# EAGLE board shieldRelayV2 (EAGLE 9.6.2)
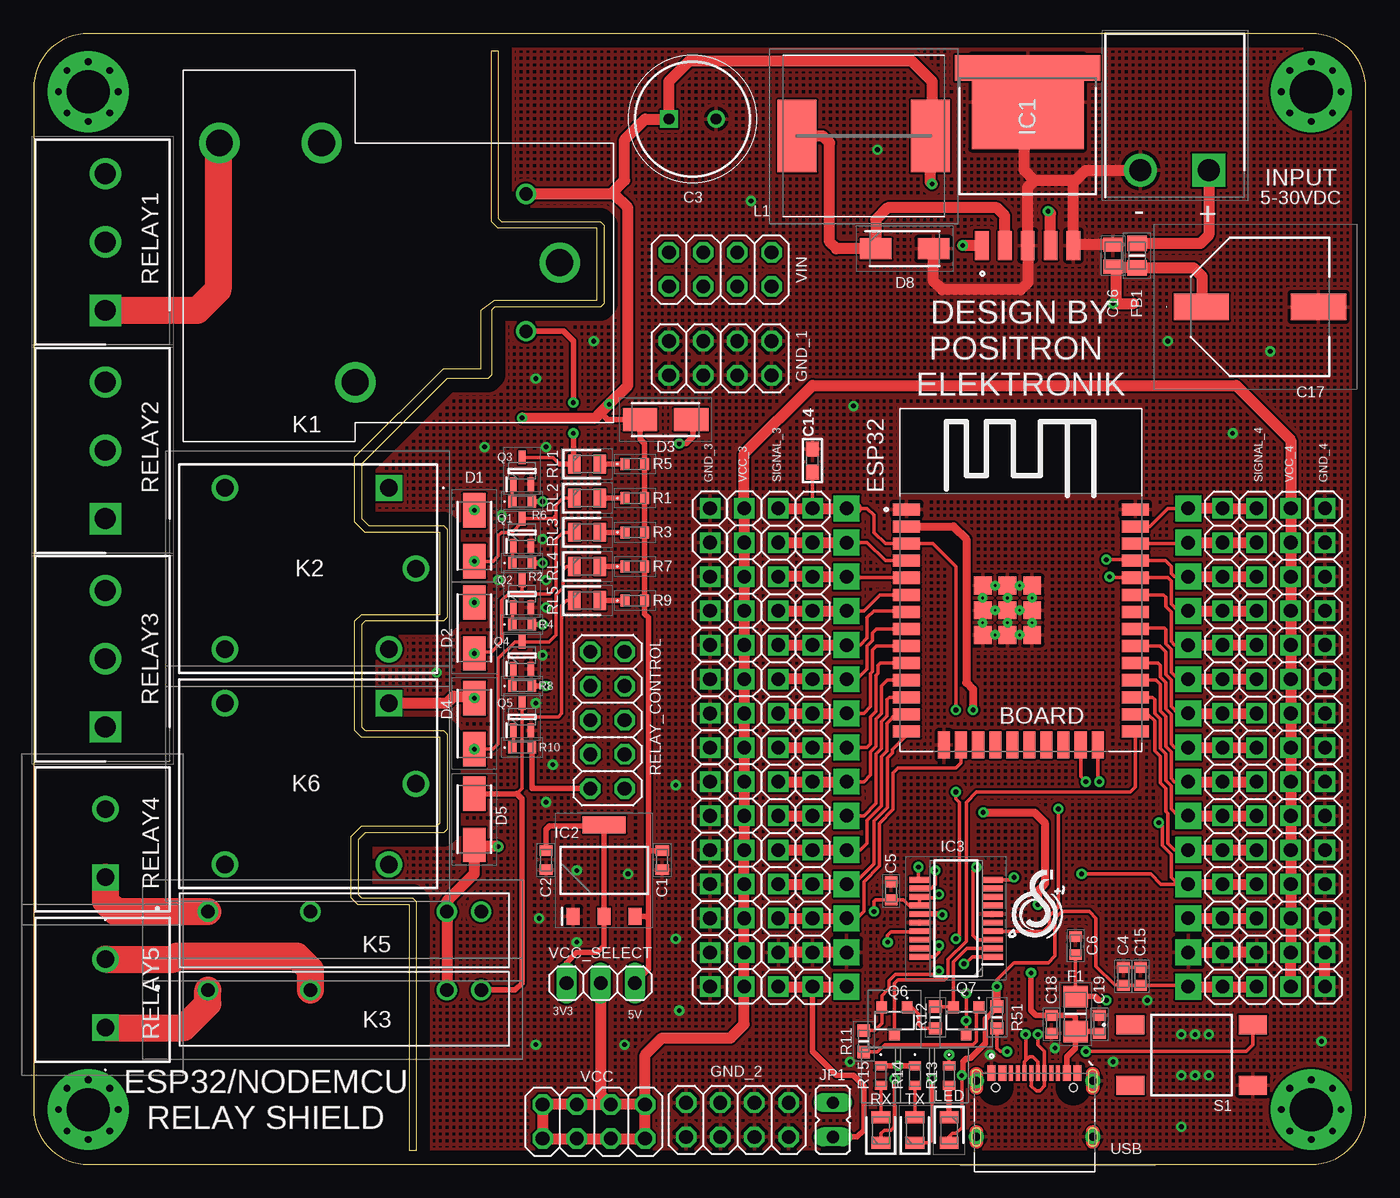
[diagram p3: board, top side]
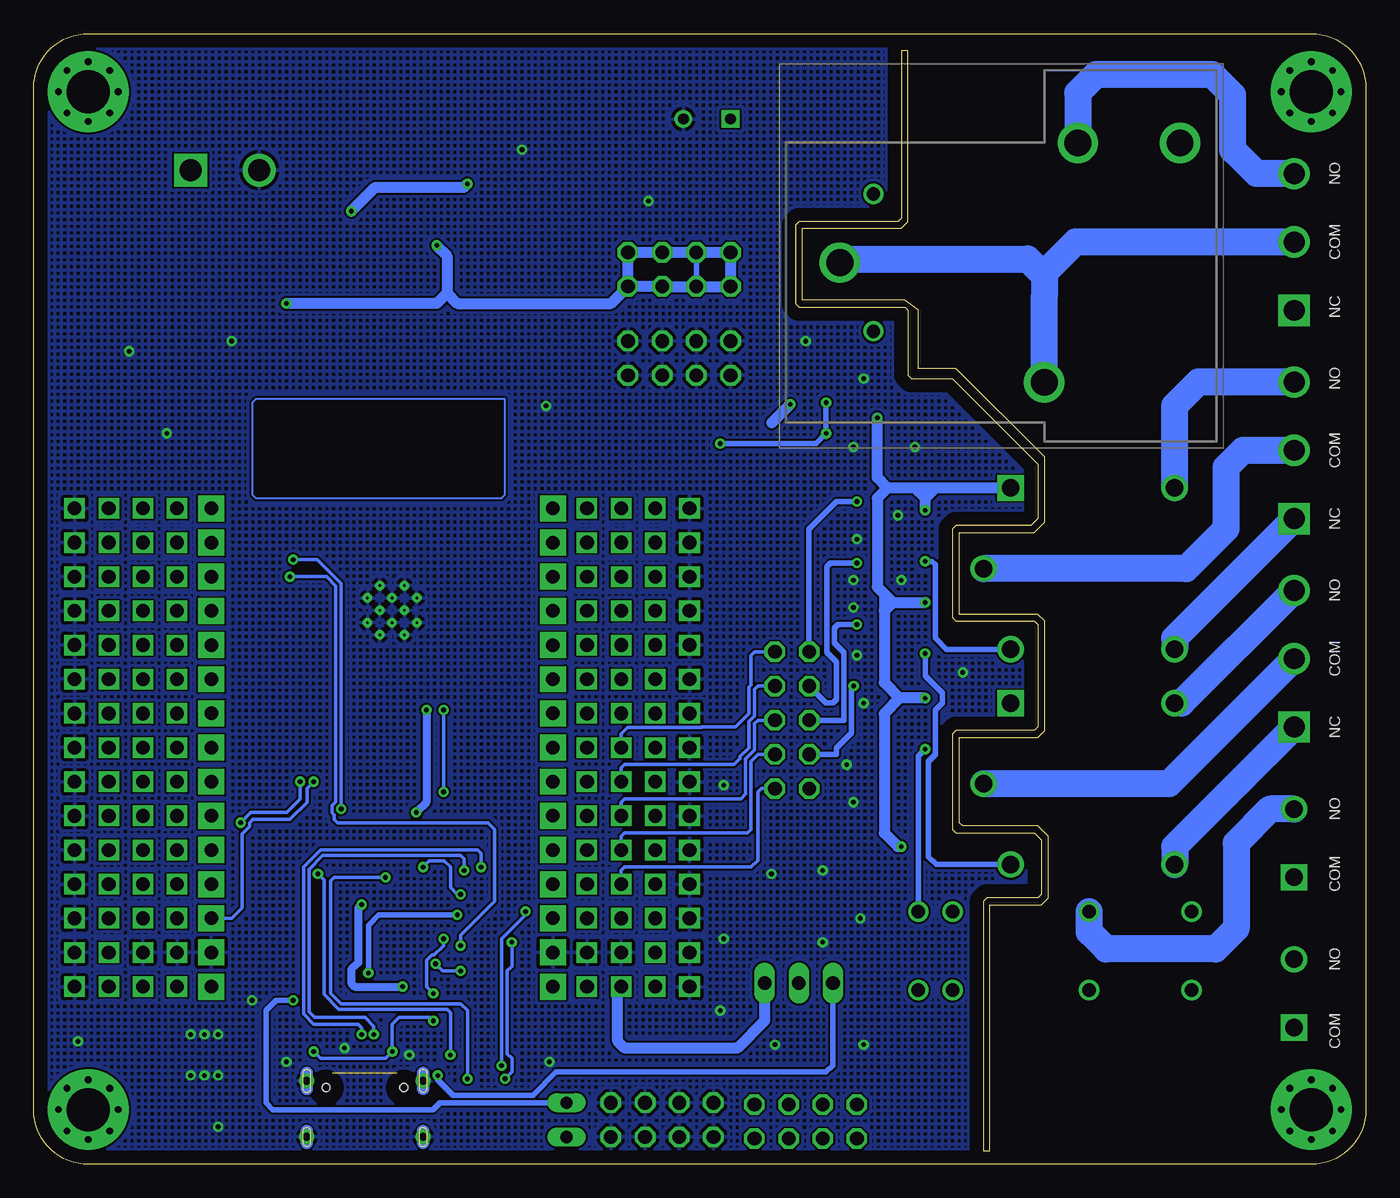
[diagram p4: board, bottom side, seen from below]

Size 99.06 x 84.07 mm. Coordinates in mm from the lower left corner, seen from the top.
Outline: 4.06,84.07 arc90 0,80.01 0,4.06 arc90 4.06,0 95,0 arc90 99.06,4.06 99.06,80.01 arc90 95,84.07 4.06,84.07
Outline: 34.54,82.8 34.54,70.36 34.8,70.1 42.16,70.1 42.42,69.85 42.42,64.01 42.16,63.75 34.29,63.75 34.04,63.5 34.04,58.67 33.78,58.42 30.73,58.42 24.38,52.07 24.38,48.01 24.89,47.5 30.48,47.5 30.73,47.24 30.73,40.64 30.48,40.39 24.64,40.39 24.38,40.13 24.38,32.51 24.64,32.26 30.48,32.26 30.73,32 30.73,24.89 30.48,24.64 24.64,24.64 24.13,24.13 24.13,20.07 24.38,19.81 28.19,19.81 28.45,19.56 28.45,1.02 27.94,1.02 27.94,19.3 24.13,19.3 23.62,19.81 23.62,24.38 24.38,25.15 29.97,25.15 30.23,25.4 30.23,31.75 24.38,31.75 23.88,32.26 23.88,40.39 24.38,40.89 30.23,40.89 30.23,46.99 24.64,46.99 23.88,47.75 23.88,52.58 30.48,59.18 33.27,59.18 33.27,63.5 34.29,64.26 41.91,64.26 41.91,69.6 34.54,69.6 34.04,70.1 34.04,82.8 34.54,82.8
Copper layers (1*16): Top 0.035mm / dielectric 1.5mm / Bottom 0.035mm
Design rules "default *": minimum track width 6mil, minimum drill 0.35mm, track to track 6mil, track to pad 6mil, pad to pad 6mil, via to via 6mil, smd to smd 6mil, copper to edge 40mil, drill to drill 6mil, minimum pad ring 10mil, minimum via ring 8mil, stop-mask expansion 4mil, vias tented up to drill 0.36mm, thermal gap 10mil

## Footprints (pad centres in the part's own frame; a part is rotated, then mirrored left to right if it is on the bottom)
ESP32-DEVKITV1 = drill 1 pad 1.93 square: 3V3 0,0; D1 30.48,0; D2 7.62,0; D3 27.94,0; D4 10.16,0; D5 17.78,0; D12 7.62,25.4; D13 5.08,25.4; D14 10.16,25.4; D15 5.08,0; D16 12.7,0; D17 15.24,0; D18 20.32,0; D19 22.86,0; D21 25.4,0; D22 33.02,0; D23 35.56,0; D25 17.78,25.4; D26 15.24,25.4; D27 12.7,25.4; D32 22.86,25.4; D33 20.32,25.4; D34 27.94,25.4; D35 25.4,25.4; EN 35.56,25.4; GND 2.54,25.4; GND@1 2.54,0; VIN 0,25.4; VN 30.48,25.4; VP 33.02,25.4
CAPC1608X95N = smd 0.78 x 0.99: 1 -0.7,0; 2 0.7,0
CAPPRD350W60D850H1250 = drill 0.8 pad 1.2 square: 1 0,0 | drill 0.8 pad 1.2: 2 3.5,0
CAPC1608X87N = smd 0.8 x 0.94: 1 -0.67,0; 2 0.67,0
0603 = smd 1.1 x 1: 1 -0.85,0; 2 0.85,0
CAPC2012X140N = smd 1.02 x 1.47: 1 -0.81,0; 2 0.81,0
EEHZS1H221P = smd 4.1 x 2: 1 -4.35,0; 2 4.35,0
DIONM5025X231N = smd 2.55 x 1.7: 1 -1.9,0; 2 1.9,0
DIOM5226X240N = smd 2.35 x 1.55: 1 -2.15,0; 2 2.15,0
MODULE_ESP32-WROOM-32D = smd 2 x 0.9: 1 -8.5,5.26; 2 -8.5,3.99; 3 -8.5,2.72; 4 -8.5,1.45; 5 -8.5,0.18; 6 -8.5,-1.09; 7 -8.5,-2.36; 8 -8.5,-3.63; 9 -8.5,-4.9; 10 -8.5,-6.17; 11 -8.5,-7.44; 12 -8.5,-8.71; 13 -8.5,-9.98; 14 -8.5,-11.25; 25 8.5,-11.25; 26 8.5,-9.98; 27 8.5,-8.71; 28 8.5,-7.44; 29 8.5,-6.17; 30 8.5,-4.9; 31 8.5,-3.63; 32 8.5,-2.36; 33 8.5,-1.09; 34 8.5,0.18; 35 8.5,1.45; 36 8.5,2.72; 37 8.5,3.99; 38 8.5,5.26 | smd 0.9 x 2: 15 -5.715,-12.25; 16 -4.445,-12.25; 17 -3.175,-12.25; 18 -1.905,-12.25; 19 -0.635,-12.25; 20 0.635,-12.25; 21 1.905,-12.25; 22 3.175,-12.25; 23 4.445,-12.25; 24 5.715,-12.25 | smd 1.33 x 1.33: 39_1 -2.835,-0.405; 39_2 -1,-0.405; 39_3 0.835,-0.405; 39_4 -2.835,-2.24; 39_5 -1,-2.24; 39_6 0.835,-2.24; 39_7 -2.835,-4.075; 39_8 -1,-4.075; 39_9 0.835,-4.075 | drill 0.2 pad 0.3: 39_10 -1.917,-0.405; 39_11 -0.083,-0.405; 39_12 -2.835,-1.323; 39_13 -1,-1.323; 39_14 0.835,-1.323; 39_15 -1.917,-2.24; 39_16 -0.083,-2.24; 39_17 -2.835,-3.158; 39_18 -1,-3.158; 39_19 0.835,-3.158; 39_20 -1.917,-4.075; 39_21 -0.083,-4.075
FUSC3216X75N = smd 1.61 x 1.82: 1 -1.3,0; 2 1.3,0
BEADC2012X105N = smd 1.15 x 1.45: 1 -0.9,0; 2 0.9,0
2X04 = drill 1.016 octagon: 1 -3.81,-1.27; 2 -3.81,1.27; 3 -1.27,-1.27; 4 -1.27,1.27; 5 1.27,-1.27; 6 1.27,1.27; 7 3.81,-1.27; 8 3.81,1.27
1X15 = drill 1.016 square: 1 -17.78,0; 2 -15.24,0; 3 -12.7,0; 4 -10.16,0; 5 -7.62,0; 6 -5.08,0; 7 -2.54,0; 8 0,0; 9 2.54,0; 10 5.08,0; 11 7.62,0; 12 10.16,0; 13 12.7,0; 14 15.24,0; 15 17.78,0
3MM_HOLE = drill 3.2 pad 6: P$1 0,0 | drill 0.5 pad 0.61: P$2 0,2.223; P$3 0,-2.223; P$4 2.223,0; P$5 -2.223,0; P$6 -1.587,1.587; P$7 1.587,1.587; P$8 1.587,-1.587; P$9 -1.587,-1.587
KTT0005B = smd 2.16 x 1.02: 1 12.461,-3.4; 2 12.461,-1.7; 3 12.461,0; 4 12.461,1.7; 5 12.461,3.4 | smd 6.99 x 8.33: 6 1.786,0 | smd 1.91 x 1.235: 7 -0.754,4.782; 8 -0.754,-4.782
SOT230P700X180-4N = smd 1.25 x 0.95: 1 -3.4,2.3; 2 -3.4,0; 3 -3.4,-2.3 | smd 1.25 x 3.2: 4 3.4,0
SOP64P599X175-20N = smd 1.526 x 0.435: 1 -2.712,2.858; 2 -2.712,2.222; 3 -2.712,1.588; 4 -2.712,0.952; 5 -2.712,0.318; 6 -2.712,-0.318; 7 -2.712,-0.952; 8 -2.712,-1.588; 9 -2.712,-2.222; 10 -2.712,-2.858; 11 2.712,-2.858; 12 2.712,-2.222; 13 2.712,-1.588; 14 2.712,-0.952; 15 2.712,-0.318; 16 2.712,0.318; 17 2.712,0.952; 18 2.712,1.588; 19 2.712,2.222; 20 2.712,2.858
SHDRRA2W103P0X508_1X2_1016X120 = drill 1.65 pad 2.475 square: 1 0,0 | drill 1.65 pad 2.475: 2 -5.08,0
JP1 = drill 0.914 long: 1 0,-1.27; 2 0,1.27
SLA05VDCSLC = drill 2 pad 3: 1 0,0; 2 8.9,15.2; 3 -8.9,17.7; 4 -8.9,25.3 | drill 1 pad 1.5: 5 5.1,2.5; 6 -5.1,2.5
SRD05VDCSLC = drill 1.3 pad 1.95 square: 1 0,0 | drill 1.3 pad 1.95: 2 12.2,0; 3 12.2,12; 4 0,12; 5 -2,6
G3MB202PLDC5 = drill 1 pad 1.5: 1 0,0; 2 -7.62,0; 3 -17.78,0; 4 -20.32,0
WE-PD_1260/1245/1280/121054 = smd 2.9 x 5.4: 1 -4.95,0; 2 4.95,0
LEDC2012X80N = smd 0.9 x 1.4: 1 -0.95,0; 2 0.95,0
SOT65P210X110-3N = smd 1 x 0.5: 1 -1,0.65; 2 -1,-0.65; 3 1,0
SI2305TP = smd 0.8 x 0.9: 1 -0.95,-1; 2 0.95,-1; 3 0,1
ERA3AEB101V = smd 0.65 x 0.9: 1 -0.725,0; 2 0.725,0
RESC1608X55N = smd 0.9 x 0.95: 1 -0.8,0; 2 0.8,0
ERJH3 = smd 0.65 x 0.9: 1 -0.725,0; 2 0.725,0
SHDR3W95P0X508_1X3_1524X1000X1 = drill 1.55 pad 2.325 square: 1 0,0 | drill 1.55 pad 2.325: 2 5.08,0; 3 10.16,0
1716080000 = drill 1.3 pad 1.95 square: 1 0,0 | drill 1.3 pad 1.95: 2 5.08,0
2X05 = drill 1.016 octagon: 1 -5.08,-1.27; 2 -5.08,1.27; 3 -2.54,-1.27; 4 -2.54,1.27; 5 0,-1.27; 6 0,1.27; 7 2.54,-1.27; 8 2.54,1.27; 9 5.08,-1.27; 10 5.08,1.27
FSM2J_1 = smd 1.4 x 2.1: 1 2.25,4.55; 2 2.25,-4.55; 3 -2.25,4.55; 4 -2.25,-4.55
HRO_TYPE-C-31-M-12 = smd 0.6 x 1.14: A1_B12 -3.2,4.75; A4_B9 -2.4,4.75; B1_A12 3.2,4.75; B4_A9 2.4,4.75 | smd 0.3 x 1.14: A5 -1.25,4.75; A6 -0.25,4.75; A7 0.25,4.75; A8 1.25,4.75; B5 1.75,4.75; B6 0.75,4.75; B7 -0.75,4.75; B8 -1.75,4.75 | drill 0.6 pad 0.9: S1 -4.325,4.17; S2 4.325,4.17; S3 -4.325,0; S4 4.325,0 | hole 0.6: -2.89,3.68; 2.89,3.68
1X03 = drill 1.016 long: 1 -2.54,0; 2 0,0; 3 2.54,0

## Placement (x,y rotation side)
BOARD  ESP32DEVKITV1  [ESP32-DEVKITV1]  85.85,13.21 90 top
C1  0.1uf  [CAPC1608X95N]  46.74,22.61 90 top
C2  0.1uf  [CAPC1608X95N]  38.1,22.61 90 top
C3  220uf 25V  [CAPPRD350W60D850H1250]  47.24,77.72 0 top
C4  10nf  [CAPC1608X87N]  81.03,13.97 270 top
C5  100nf  [CAPC1608X87N]  63.75,20.32 90 top
C6  100nf  [CAPC1608X87N]  77.47,16.26 90 top
C14  1uF  [0603]  57.91,52.32 90 top
C15  100nf  [CAPC1608X87N]  82.3,13.97 270 top
C16  2.2uf  [CAPC2012X140N]  80.26,67.56 90 top
C17  680uf  [EEHZS1H221P]  91.19,63.75 0 top
C18  100nf  [CAPC1608X87N]  75.69,10.41 90 top
C19  100nf  [CAPC1608X87N]  79.25,10.41 90 top
D1  FM4004-W  [DIONM5025X231N]  32.77,46.74 270 top
D2  FM4004-W  [DIONM5025X231N]  32.77,39.88 270 top
D3  FM4004-W  [DIONM5025X231N]  46.99,55.37 0 top
D4  FM4004-W  [DIONM5025X231N]  32.77,32.77 270 top
D5  FM4004-W  [DIONM5025X231N]  32.77,25.65 90 top
D8  B340A-13-F  [DIOM5226X240N]  64.77,68.07 0 top
ESP32  ESP32-WROOM-32D  [MODULE_ESP32-WROOM-32D]  73.41,43.43 0 top
F1  0ZCJ0010FF2E  [FUSC3216X75N]  77.47,11.18 90 top
FB1  BLM21PG221SN1D  [BEADC2012X105N]  82.04,67.56 90 top
GND_1  [2X04]  51.05,59.94 0 top
GND_2  [2X04]  52.32,3.3 0 top
GND_3  [1X15]  50.29,30.99 270 top
GND_4  [1X15]  96.01,30.99 270 top
H1  3MM_HOLE  [3MM_HOLE]  4.06,79.76 0 top
H2  3MM_HOLE  [3MM_HOLE]  95,79.76 0 top
H3  3MM_HOLE  [3MM_HOLE]  95,4.06 0 top
H4  3MM_HOLE  [3MM_HOLE]  4.06,4.06 0 top
IC1  LM2596SX-5.0_NOPB  [KTT0005B]  73.91,80.77 270 top
IC2  LM1117MPX-33NOPB  [SOT230P700X180-4N]  42.42,21.84 90 top
IC3  FT231XS-R  [SOP64P599X175-20N]  68.58,18.29 180 top
INPUT  1759017  [SHDRRA2W103P0X508_1X2_1016X120]  87.38,73.91 0 top
JP1  [JP1]  59.44,3.3 180 top
JP11  [1X15]  88.39,30.99 90 top
JP12  [1X15]  57.91,30.99 90 top
K1  SLA-05VDC-SL-C  [SLA05VDCSLC]  39.12,67.05 270 bottom
K2  SRD-05VDC-SL-C  [SRD05VDCSLC]  26.42,50.29 180 top
K3  G3MB-202PL-DC5  [G3MB202PLDC5]  12.95,12.95 180 top
K5  G3MB-202PL-DC5  [G3MB202PLDC5]  12.95,18.8 180 top
K6  SRD-05VDC-SL-C  [SRD05VDCSLC]  26.42,34.29 180 top
L1  33uh 12x12  [WE-PD_1260/1245/1280/121054]  61.72,76.45 0 top
LED  Green  [LEDC2012X80N]  68.07,2.54 270 top
Q1  MMST2222A-7-F  [SOT65P210X110-3N]  36.32,46.99 90 top
Q2  MMST2222A-7-F  [SOT65P210X110-3N]  36.32,42.42 90 top
Q3  MMST2222A-7-F  [SOT65P210X110-3N]  36.32,51.56 90 top
Q4  MMST2222A-7-F  [SOT65P210X110-3N]  36.32,37.85 90 top
Q5  MMST2222A-7-F  [SOT65P210X110-3N]  36.32,33.27 90 top
Q6  MMBT3904-TP  [SI2305TP]  64.01,10.67 180 top
Q7  MMBT3904-TP  [SI2305TP]  69.34,10.67 180 top
R1  1k  [ERA3AEB101V]  44.7,49.53 0 top
R2  1k  [ERA3AEB101V]  36.32,44.7 0 top
R3  1k  [ERA3AEB101V]  44.7,46.99 0 top
R4  1k  [ERA3AEB101V]  36.32,40.13 0 top
R5  1k  [ERA3AEB101V]  44.7,52.07 0 top
R6  1k  [ERA3AEB101V]  36.32,49.28 0 top
R7  1k  [ERA3AEB101V]  44.7,44.45 0 top
R8  1k  [ERA3AEB101V]  36.32,35.56 0 top
R9  1k  [ERA3AEB101V]  44.7,41.91 0 top
R10  1k  [ERA3AEB101V]  36.32,30.99 0 top
R11  10k  [RESC1608X55N]  61.72,9.14 270 top
R12  10k  [RESC1608X55N]  67.06,10.92 270 top
R13  330  [ERJH3]  68.07,6.6 270 top
R14  330  [ERJH3]  65.53,6.6 270 top
R15  330  [ERJH3]  62.99,6.6 270 top
R51  10k  [RESC1608X55N]  71.63,10.92 270 top
RELAY1  1716090000  [SHDR3W95P0X508_1X3_1524X1000X1]  5.33,63.5 90 top
RELAY2  1716090000  [SHDR3W95P0X508_1X3_1524X1000X1]  5.33,48.01 90 top
RELAY3  1716090000  [SHDR3W95P0X508_1X3_1524X1000X1]  5.33,32.51 90 top
RELAY4  1716080000  [1716080000]  5.33,21.34 90 top
RELAY5  1716080000  [1716080000]  5.33,10.16 90 top
RELAY_CONTROL  [2X05]  42.67,33.02 270 top
RL1  150080SS75000  [LEDC2012X80N]  41.15,52.07 0 top
RL2  150080SS75000  [LEDC2012X80N]  41.15,49.53 0 top
RL3  150080SS75000  [LEDC2012X80N]  41.15,46.99 0 top
RL4  150080SS75000  [LEDC2012X80N]  41.15,44.45 0 top
RL5  150080SS75000  [LEDC2012X80N]  41.15,41.91 0 top
RX  Green  [LEDC2012X80N]  62.99,2.54 90 top
S1  FSM2JSMAATR  [FSM2J_1]  86.11,8.13 90 top
SIGNAL_3  [1X15]  55.37,30.99 90 top
SIGNAL_4  [1X15]  90.93,30.99 90 top
TX  Green  [LEDC2012X80N]  65.53,2.54 90 top
USB  TYPE-C-31-M-12  [HRO_TYPE-C-31-M-12]  74.42,2.03 0 top
VCC  [2X04]  41.66,3.18 0 top
VCC_3  [1X15]  52.83,30.99 270 top
VCC_4  [1X15]  93.47,30.99 90 top
VCC_SELECT  [1X03]  42.16,13.46 180 top
VIN  [2X04]  51.05,66.55 0 top

## Tracks (layer width: path | path; a pad name or v marks a point on that pad's centre or on a via)
0
  Top 0.254: Q6.3 64.01,13.46 64.26,13.72 67.73,13.72 67.99,13.97 67.99,15.22 69.34,16.58 69.34,26.92 70.1,27.69 81.53,27.69 81.91,28.06 ESP32.25
3  (via drill 0.35)
  Top 0.254: ESP32.23 77.85,28.83 v78.23,28.45
  Top 0.813: BOARD.D15 JP11.3 SIGNAL_4.3
  Bottom 0.254: v78.23,28.45 78.74,27.94 78.74,26.92 80.01,25.65 82.76,25.65 83.01,25.4 83.01,25.13 83.57,24.57 83.57,19.05 84.33,18.29 BOARD.D15
3V3_OUT  (via drill 0.35)
  Top 0.254: IC3.14 65.87,19.81 | 65.87,19.81 IC3.13 | IC3.14 65.84,19.27 | IC3.14 65.09,19.24 64.68,19.65 C5.1 62.58,19.65 62.48,19.56 v62.48,18.8 | IC3.3 70.17,16.7 69.85,17.02 69.85,21.84 v70.1,22.1 | v67.31,20.07 67.06,19.81 65.87,19.81
  Top 0.406: R15.1 v64.26,7.33 R14.1
  Bottom 0.254: v64.26,7.33 64.26,16.76 62.48,18.54 v62.48,18.8 | v70.1,22.1 69.65,22.56 68.53,22.56 68.07,22.1 68.07,20.57 67.56,20.07 v67.31,20.07
4  (via drill 0.35)
  Top 0.254: R13.1 v68.07,8.13 | v77.93,21.59 83.06,21.59 83.82,20.83 85.09,20.83 | 85.09,20.83 BOARD.D2 | ESP32.24 79.12,28.57 v79.25,28.45 | v83.67,25.4 83.92,25.15 83.92,23.71 84.58,23.05 84.58,21.34 85.09,20.83
  Top 0.813: BOARD.D2 JP11.4 SIGNAL_4.4
  Bottom 0.254: v68.07,8.13 68.07,11.28 68.33,11.53 76.37,11.53 77.47,12.63 77.47,21.13 v77.93,21.59 | v79.25,28.45 79.25,27.18 80.26,26.16 82.91,26.16 v83.67,25.4
5
  Top 0.254: ESP32.26 82.86,33.45 83.36,32.96 83.36,30.74 83.77,30.33 83.77,28.36 84.18,27.96 84.18,26.25 84.33,26.1 84.33,23.88 84.84,23.37 BOARD.D4
  Top 0.813: BOARD.D4 JP11.5 SIGNAL_4.5
6
  Top 0.254: ESP32.27 83.18,34.72 83.36,34.54 83.36,33.53 83.77,33.12 83.77,30.9 84.18,30.5 84.18,28.53 84.58,28.13 84.58,26.42 85.09,25.91 BOARD.D16
  Top 0.813: BOARD.D16 JP11.6 SIGNAL_4.6
7
  Top 0.254: ESP32.28 83.44,35.99 83.77,35.67 83.77,33.7 84.18,33.29 84.18,31.07 84.58,30.67 84.58,28.7 84.84,28.45 BOARD.D17
  Top 0.813: BOARD.D17 JP11.7 SIGNAL_4.7
8
  Top 0.254: ESP32.29 83.59,37.26 83.77,37.08 83.77,36.24 84.18,35.83 84.18,33.87 84.58,33.46 84.58,31.24 84.84,30.99 BOARD.D5
  Top 0.813: BOARD.D5 JP11.8 SIGNAL_4.8
9
  Top 0.254: ESP32.30 83.74,38.53 84.18,38.1 84.18,36.41 84.58,36 84.58,34.04 85.09,33.53 BOARD.D18
  Top 0.813: BOARD.D18 JP11.9 SIGNAL_4.9
10
  Top 0.254: ESP32.31 81.98,39.88 84.07,39.88 84.18,39.78 84.18,38.69 84.58,38.29 84.58,36.58 85.09,36.07 BOARD.D19
  Top 0.813: BOARD.D19 JP11.10 SIGNAL_4.10
11
  Top 0.254: ESP32.33 84,42.34 84.18,42.16 84.18,41.49 84.58,41.08 84.58,38.86 84.84,38.61 BOARD.D21
  Top 0.813: BOARD.D21 JP11.11 SIGNAL_4.11
12  (via drill 0.35)
  Top 0.254: v80.01,43.69 80.08,43.61 ESP32.34 84.33,43.61 84.58,43.37 84.58,41.66 85.09,41.15 BOARD.D3 | IC3.20 66.99,15.43 67.31,15.75 v67.31,16.26
  Top 0.813: BOARD.D3 JP11.12 SIGNAL_4.12
  Bottom 0.254: v80.01,43.69 77.28,43.69 76.61,43.01 76.61,26.94 76.86,26.69 76.86,26.14 76.71,25.99 76.71,25.65 76.45,25.4 65.28,25.4 64.77,24.89 64.77,19.56 67.31,17.02 v67.31,16.26
13  (via drill 0.35)
  Top 0.254: IC3.4 75.1,17.34 75.54,17.78 75.54,18.46 76.2,19.12 v76.2,26.42 | v79.76,44.96 81.83,44.96 ESP32.35 84.15,44.88 84.58,44.45 84.58,43.94 84.84,43.69 BOARD.D1
  Top 0.813: BOARD.D1 JP11.13 SIGNAL_4.13
  Bottom 0.254: v76.2,26.42 76.2,43.18 77.98,44.96 v79.76,44.96
14
  Top 0.254: ESP32.36 85.78,46.15 BOARD.D22
  Top 0.813: BOARD.D22 JP11.14 SIGNAL_4.14
15
  Top 0.254: ESP32.37 82.98,47.42 84.33,48.77 BOARD.D23
  Top 0.813: BOARD.D23 JP11.15 SIGNAL_4.15
18
  Top 0.254: ESP32.16 68.96,29.85 68.58,29.46 64.26,29.46 63.91,29.11 63.91,26.37 62.89,25.35 62.89,22.18 61.72,21.02 61.72,18.8 61.21,18.29 BOARD.D13
  Top 0.813: SIGNAL_3.3 JP12.3 BOARD.D13
19
  Top 0.254: BOARD.D12 60.96,20.83 62.48,22.35 62.48,25.52 63.5,26.54 63.5,30.21 63.86,30.57 63.86,30.84 64.91,31.89 ESP32.14
  Top 0.813: SIGNAL_3.4 JP12.4 BOARD.D12
  Bottom 0.254: SIGNAL_3.4 55.37,21.84 55.12,22.1 45.72,22.1 45.21,22.61 45.21,27.69 44.96,27.94 RELAY_CONTROL.10
20
  Top 0.254: ESP32.13 64.73,33.27 63.86,33.27 63.86,33.17 63.45,32.77 63.45,30.74 63.04,30.33 63.04,26.65 61.98,25.59 61.98,23.88 61.47,23.37 BOARD.D14
  Top 0.813: SIGNAL_3.5 JP12.5 BOARD.D14
  Bottom 0.254: SIGNAL_3.5 55.37,24.38 55.12,24.64 45.97,24.64 45.72,24.89 45.72,29.97 45.21,30.48 RELAY_CONTROL.8
21
  Top 0.254: ESP32.12 63.63,34.72 63.45,34.54 63.45,33.34 63.04,32.94 63.04,30.9 62.64,30.5 62.64,26.82 61.72,25.91 60.71,25.91
  Top 0.813: SIGNAL_3.6 JP12.6 BOARD.D27 60.71,25.91
  Bottom 0.254: SIGNAL_3.6 55.37,26.92 55.12,27.18 46.48,27.18 46.13,27.53 46.13,30.14 45.47,30.8 45.47,32.77 45.21,33.02 RELAY_CONTROL.6
22
  Top 0.254: ESP32.11 63.48,35.99 63.04,35.56 63.04,33.51 62.64,33.11 62.64,31.07 62.23,30.67 62.23,28.96 61.72,28.45 BOARD.D26
  Top 0.813: SIGNAL_3.7 JP12.7 BOARD.D26
  Bottom 0.254: SIGNAL_3.7 55.37,29.46 55.12,29.72 46.99,29.72 46.53,30.18 46.53,30.31 45.87,30.97 45.87,32.93 45.47,33.34 45.47,35.31 45.21,35.56 RELAY_CONTROL.4
23
  Top 0.254: ESP32.10 62.97,37.26 62.79,37.08 62.79,36.49 62.64,36.34 62.64,33.68 62.23,33.27 62.23,31.24 61.98,30.99 BOARD.D25
  Top 0.813: SIGNAL_3.8 JP12.8 BOARD.D25
  Bottom 0.254: SIGNAL_3.8 55.37,32 54.89,32.49 49.41,32.49 49.39,32.51 46.89,32.51 45.87,33.53 45.87,35.47 45.72,35.63 45.72,37.85 45.47,38.1 RELAY_CONTROL.2
24
  Top 0.254: BOARD.D33 61.72,33.53 62.23,34.04 62.23,36.51 62.38,36.66 62.38,38.25 62.66,38.53 ESP32.9
  Top 0.813: SIGNAL_3.9 JP12.9 BOARD.D33
25
  Top 0.254: ESP32.8 62.66,39.8 62.38,39.52 62.38,38.95 61.98,38.54 61.98,36.83 61.21,36.07 BOARD.D32
  Top 0.813: SIGNAL_3.10 JP12.10 BOARD.D32
26
  Top 0.254: BOARD.D35 61.47,38.61 61.98,39.12 61.98,40.64 62.48,41.15 64.83,41.15 ESP32.7
  Top 0.813: SIGNAL_3.11 JP12.11 BOARD.D35
27
  Top 0.254: BOARD.D34 61.72,41.15 62.92,42.34 ESP32.6
  Top 0.813: SIGNAL_3.12 JP12.12 BOARD.D34
28
  Top 0.254: ESP32.5 60.53,43.61 BOARD.VN
  Top 0.813: SIGNAL_3.13 JP12.13 BOARD.VN
29
  Top 0.254: ESP32.4 63.32,44.88 61.98,46.23 BOARD.VP
  Top 0.813: SIGNAL_3.14 JP12.14 BOARD.VP
30  (via drill 0.35)
  Top 0.254: S1.2 90.66,8.87 90.17,8.38 v78.23,8.38 | v72.39,8.38 71.88,8.38 71.63,8.64 R51.2 | Q7.3 v69.34,10.67 v69.34,12.7 | 61.21,48.77 61.98,48.77 62.48,48.26 62.48,46.99 63.32,46.15 ESP32.3 66.88,46.15 68.58,44.45 v68.58,33.78 | C14.1 JP12.15 | v68.58,27.69 68.58,27.18 68.83,26.92 68.83,17.02 v68.58,16.76
  Top 0.813: SIGNAL_3.15 JP12.15 BOARD.EN 61.21,48.77
  Bottom 0.254: v78.23,8.38 77.72,7.87 72.9,7.87 v72.39,8.38 72.39,10.41 71.88,10.92 69.6,10.92 v69.34,10.67 | v68.58,33.78 v68.58,27.69 | v68.58,16.76 68.58,16.26 69.28,15.56 69.44,15.56 69.85,15.15 69.85,13.21 v69.34,12.7
+3V3  (via drill 0.35)
  Top 0.254: v71.63,13.21 71.63,13.72 72.9,14.99 75.44,14.99 75.95,15.49 75.95,18.29 76.45,18.8 78.49,18.8 78.99,18.29 78.99,14.73 80.39,13.34 80.99,13.34 C4.2 C15.2 85.76,13.3 BOARD.3V3 | 70.76,10.82 70.76,10.67 | 69.09,6.6 v69.01,6.6 69.01,4.1 69.05,4.06 69.05,2.76 68.58,2.29 68.33,2.29 68.07,2.03 LED.2
  Top 0.406: 42.42,25.15 IC2.2 42.42,16.26 41.91,15.75 40.39,15.75 39.62,14.99 VCC_SELECT.3 | 42.42,25.15 IC2.4 | C2.2 38.1,24.89 38.35,25.15 42.42,25.15 | 70.76,10.82 70.81,10.86 70.84,10.86 71.63,11.65 R51.1 | 70.76,10.67 70.76,8.98 69.66,7.87 69.34,7.87 69.09,7.62 69.09,6.6
  Top 0.61: ESP32.2 68.4,47.42 69.34,46.48 69.34,35.81 69.85,35.31 v69.85,33.78 | v70.61,26.16 74.42,26.16 75.18,25.4 75.18,20.83 74.68,20.32 v74.68,19.3 | R51.1 v71.63,13.21
  Top 0.813: BOARD.3V3 JP11.1 SIGNAL_4.1
  Bottom 0.406: v69.01,6.6 69.01,6.27 67.87,5.13 61.92,5.13 60.2,6.86 40.13,6.86 39.62,7.37 VCC_SELECT.3
  Bottom 0.61: v70.61,26.16 69.85,26.92 v69.85,33.78 | v74.68,19.3 74.93,19.05 74.93,14.99 75.44,14.48 75.44,13.46 75.18,13.21 v71.63,13.21
+5V  (via drill 0.35)
  Top 0.406: VCC_SELECT.1 45.72,14.48 45.72,18.29 | 45.72,18.29 45.72,23.37 | 45.72,23.37 45.72,40.64 45.43,40.93 R9.2 R7.2 R3.2 R1.2 R5.2 45.43,53.59 45.09,53.93 D3.1 42.67,55.37 42.16,55.88 | IC2.3 45.56,18.44 45.72,18.29 | C1.2 45.78,23.31 45.72,23.37 | JP1.2 61.21,2.03 61.72,2.54 61.72,5.84 60.96,6.6 59.69,6.6 57.91,8.38 JP12.1
  Top 0.813: IC1.4 75.61,70.69 v75.44,70.87 | v66.8,72.9 66.67,73.03 66.67,75.95 | 66.67,75.95 L1.2 | 66.67,75.95 66.8,76.08 66.8,80.52 65.28,82.04 48.77,82.04 47.24,80.52 C3.1 45.47,77.72 43.94,76.2 43.94,73.16 42.93,72.15 | v36.32,55.49 41.78,55.49 42.16,55.88 v42.8,56.52 44.2,57.91 44.2,71.12 43.17,72.15 42.93,72.15 | D1.1 32.64,48.51 | K3.3 K5.3 30.73,19.57 32.77,21.6 D5.1 32.9,23.62 v34.54,23.62 | K6.1 30.73,34.29 31.24,34.8 32.63,34.8 D4.1 | SIGNAL_3.1 JP12.1 BOARD.VIN | 42.93,72.15 K1.6
  Bottom 0.813: v75.44,70.87 73.66,72.64 67.06,72.64 v66.8,72.9 | K2.1 32,50.29 | 32,50.29 33.53,50.29 | 33.53,50.29 35.56,50.29 | v36.32,55.49 36.32,51.05 35.56,50.29 | 35.56,50.29 36.32,49.53 36.32,42.93 35.81,42.42 | 35.81,42.42 35.81,41.15 | 35.81,41.15 35.81,35.81 34.67,34.67 | D4.1 34.67,34.67 | D1.1 32.77,49.53 | 32.77,49.53 32,50.29 | 32.77,49.53 33.53,50.29 | 34.67,34.67 35.81,33.52 35.81,24.64 34.8,23.62 v34.54,23.62 | 35.17,41.78 35.18,41.78 35.81,41.15 | 35.17,41.78 35.81,42.42 | VCC_SELECT.1 44.7,10.67 46.74,8.64 55.12,8.64 55.63,9.14 55.63,12.95 SIGNAL_3.1 | 44.2,55.12 v42.8,56.52 | 35.17,41.78 D2.1
  other vias: 32.77,34.67 32.77,48.64 32.77,41.78
CBUS1  (via drill 0.35)
  Top 0.254: RX.1 62.99,2.29 63.25,2.54 63.75,2.54 64.01,2.79 v64.01,6.35 | IC3.17 65.8,17.27 63.75,17.27 63.5,17.02 v63.5,16.51
  Bottom 0.254: v64.01,6.35 63.5,6.86 63.5,7.87 63.86,8.23 63.86,14.38 63.5,14.73 v63.5,16.51
CBUS2  (via drill 0.35)
  Top 0.254: TX.1 66.61,1.59 66.8,1.78 v66.8,6.35 | v72.9,21.34 72.71,21.15 IC3.10
  Bottom 0.254: v66.8,6.35 66.8,11.43 67.31,11.94 76.2,11.94 76.96,12.7 76.96,21.08 76.71,21.34 v72.9,21.34
COM1
  Bottom 2: RELAY2.2 9.14,53.09 10.41,51.82 10.41,47.24 13.37,44.29 K2.5
COM2
  Bottom 2: RELAY1.2 21.59,68.58 23.92,66.25 23.92,66.08 | K1.2 23.92,64.52 23.92,66.08 | K1.1 38.85,67.31 25.15,67.31 23.92,66.08
COM3
  Bottom 2: RELAY3.2 14.64,28.29 K6.5
COM4
  Top 2: RELAY5.1 11.18,10.16 12.95,11.94 K3.1
COM5
  Top 2: RELAY4.1 5.33,19.56 6.1,18.8 K5.1
D+  (via drill 0.35)
  Top 0.254: USB.A6 74.17,5.85 74.17,5.84 74.55,5.46 74.8,5.46 75.17,5.83 USB.B6 75.17,8.39 74.68,8.89 v74.68,9.65 | IC3.11 65.79,21.23 v65.79,22.1
  Bottom 0.254: v74.68,9.65 74.68,10.16 74.93,10.41 78.23,10.41 78.99,11.18 78.99,22.1 77.72,23.37 66.04,23.37 65.79,23.11 v65.79,22.1
D-  (via drill 0.35)
  Top 0.254: USB.A7 74.67,7.62 74.68,7.62 74.3,8 74.04,8 73.77,7.73 | USB.B7 73.67,7.63 73.77,7.73 | IC3.12 66.74,20.51 67.06,20.83 v67.06,21.84 | v73.77,9.65 73.77,7.73
  Bottom 0.254: v67.06,21.84 67.06,22.71 67.31,22.96 77.56,22.96 78.59,21.93 78.59,11.34 78.17,10.92 74.42,10.92 73.77,10.27 v73.77,9.65
DTR  (via drill 0.35)
  Top 0.254: Q6.2 63.06,10.48 62.52,9.94 R11.1 | 63.04,11.68 Q6.2 | IC3.1 69.79,15.43 69.26,14.9 v69.17,14.9 | Q6.2 63.06,12.51 63.5,12.95 63.6,12.95 63.6,13.63 64.09,14.12 67.06,14.12 v67.31,14.37
  Bottom 0.254: v69.17,14.9 69.05,14.78 68.64,14.37 v67.31,14.37
GND  (via drill 0.35)
  Top 0.254: C15.1 C4.1
  Top 0.813: C16.2 77.38,68.37 IC1.5 77.31,73 | INPUT.2 78.23,73.91 77.31,73 | 77.31,73 77.16,73.15 74.42,73.15 | 74.42,73.15 73.66,73.91 73.66,78.73 IC1.6 | 74.42,73.15 73.91,72.64 IC1.3 73.91,65.53 73.41,65.02 67.56,65.02 66.92,65.67 D8.2 | BOARD.GND JP12.2 SIGNAL_3.2 | BOARD.GND@1 JP11.2 SIGNAL_4.2 | GND_4.13 GND_4.14 GND_4.15
  other vias: 29.97,36.58 37.85,37.85 37.34,34.29 38.61,29.72 38.1,26.92 47.75,28.19 44.2,21.59 40.39,21.84 37.59,18.29 40.39,16.51 47.75,16.76 48.01,11.43 43.94,8.89 37.34,8.89 60.71,7.62 85.34,2.79 95.76,9.14 60.96,56.39 91.95,60.45 84.33,61.21 89.15,54.36 62.74,75.44 53.34,71.63 41.66,61.21 85.34,6.6 85.34,9.65 86.36,9.65 87.38,9.65 86.36,6.6 87.38,6.6 80.26,7.62 82.8,12.19 71.12,8.13 75.95,8.64 37.34,58.42 38.1,53.34 33.53,53.34 38.1,43.43 34.54,43.43 38.1,41.4 37.85,46.48 34.8,48.26
  pour Top (hatched): 99.06,84.07 99.06,0 29.21,0 29.21,20.32 24.89,20.32 24.89,23.88 31.24,23.88 31.24,32.77 24.89,32.77 24.89,39.88 31.24,39.88 31.24,48.01 24.89,48.01 24.89,51.82 30.99,57.91 34.54,57.91 34.54,63.25 42.93,63.25 42.93,70.61 35.31,70.61 35.31,84.07
  pour Bottom (hatched): 35.31,84.07 99.06,84.07 99.06,0 29.21,0 29.21,20.32 24.89,20.32 24.89,23.88 31.24,23.88 31.24,32.77 24.89,32.77 24.89,39.88 31.24,39.88 31.24,48.01 24.89,48.01 24.89,51.82 30.99,57.91 34.54,57.91 34.54,63.25 42.93,63.25 42.93,70.61 35.31,70.61
IN1  (via drill 0.35)
  Top 0.406: R6.2 v37.85,49.28
  Bottom 0.406: v37.85,49.28 39.37,49.28 41.4,47.24 RELAY_CONTROL.1
IN2  (via drill 0.35)
  Top 0.406: R2.2 v37.85,44.7
  Bottom 0.406: v37.85,44.7 39.83,44.7 40.08,44.45 40.08,38.05 39.37,37.34 39.37,34.54 39.62,34.29 40.13,34.29 RELAY_CONTROL.3
IN3  (via drill 0.35)
  Top 0.406: R4.2 v37.85,40.13
  Bottom 0.406: v37.85,40.13 39.27,40.13 39.52,39.88 39.52,38.76 38.81,38.05 38.81,33.02 RELAY_CONTROL.5
IN4  (via drill 0.35)
  Top 0.406: R8.2 v38.08,35.56
  Bottom 0.406: v38.08,35.56 38.25,35.39 38.25,32.08 39.37,30.96 39.37,30.48 RELAY_CONTROL.7
IN5
  Top 0.406: R10.2 37.05,27.94 RELAY_CONTROL.9
N$1
  Top 0.406: RL3.2 R3.1
N$2
  Top 0.406: RL2.2 R1.1
N$3  (via drill 0.35)
  Top 0.254: D1.2 34.17,44.84 34.54,45.21 34.54,46.74 34.8,46.99 35.56,46.99 36.32,47.75 Q1.3 36.34,48.01 38.61,48.01 38.86,48.26 | 38.86,47.5 38.86,48.26 | 38.86,48.26 38.86,49.02 39.37,49.53 RL2.1
  Bottom 0.406: K2.4 31.18,38.29 32,39.12 32,44.58 32.26,44.84 D1.2
  other vias: 32.77,44.84
N$4
  Top 0.254: R4.1 35.6,41.34 Q2.1
N$5  (via drill 0.35)
  Top 0.254: D2.2 32.89,38.1 34.04,38.1 34.8,38.86 34.8,41.91 35.31,42.42 35.56,42.42 36.07,42.42 | 36.97,42.28 36.83,42.42 | 36.07,42.42 36.58,42.42 | RL3.1 39.37,46.99 38.86,46.48 38.86,42.93 38.35,42.42 37.59,42.42 37.11,42.42 36.83,42.42 | 36.32,43.18 Q2.3 36.32,42.67 | 36.32,42.67 36.07,42.42 | 36.32,42.67 36.58,42.42 | 36.58,42.42 36.83,42.42
  Bottom 0.406: D2.2 32.77,36.32 31.5,35.05 31.5,34.29 32,33.78 32,30.48 32.51,29.97 32.51,22.86 31.94,22.29 K6.4
  other vias: 32.77,37.98
N$7
  Top 0.406: R5.1 RL1.2
N$8  (via drill 0.35)
  Top 0.254: 39.12,52.07 38.73,52.45 38.62,52.56 Q3.3
  Top 0.406: 39.12,52.07 RL1.1 40.13,52.14 v40.13,54.36 | v40.13,56.64 40.13,61.21 39.4,61.95 K1.5 | v48.01,53.59 48.51,53.59 49.02,54.1 49.02,55.24 D3.2
  Bottom 0.406: v40.13,54.36 v40.13,56.64 | v40.13,54.36 40.13,54.1 | v40.13,54.36 40.89,53.59 v48.01,53.59
N$9
  Top 0.254: R2.1 35.6,45.92 Q1.1
N$10
  Top 0.406: RL4.2 R7.1
N$11  (via drill 0.35)
  Top 0.254: D4.2 34.17,30.87 34.54,31.24 34.54,37.59 35.8,38.85 Q4.3 38.34,38.85 38.86,39.37 38.86,42.35 39.37,42.86 39.37,44.2 39.62,44.45 RL4.1
  Bottom 0.406: D4.2 33.27,30.36 K5.4
  other vias: 32.77,30.87
N$12
  Top 0.254: R8.1 35.6,36.77 Q4.1
N$13
  Top 0.406: RL5.2 R9.1
N$14
  Top 0.254: 35.94,27.56 36.32,27.94 36.32,32 36.32,33.27 | RL5.1 39.62,41.91 39.27,41.55 39.27,33.53 39.01,33.27 36.32,33.27 | Q5.3 36.32,33.27
  Top 0.406: D5.2 35.94,27.55 | 35.94,27.55 35.94,27.56 | 35.94,27.55 36.32,27.17 36.32,13.46 35.81,12.95 K3.4
N$15
  Top 0.254: Q3.1 35.67,50.15 35.56,50.04 35.56,49.31 R6.1
N$16
  Top 0.254: R11.2 62.74,8.34 63.28,8.89 69.85,8.89 70.1,9.14 70.1,11.48 Q7.1
N$17
  Top 0.254: R12.2 66.08,10.12 65.79,10.41 65.79,11.18 65.29,11.67 Q6.1
N$18
  Top 0.813: IC1.2 72.21,70.53 71.63,71.12 63.5,71.12 62.62,70.24 D8.1 59.69,68.07 59.18,68.58 59.18,75.95 58.67,76.45 L1.1
N$19
  Top 0.254: R15.2 RX.2
N$20
  Top 0.254: R14.2 TX.2
N$21
  Bottom 0.152: 64.01,56.9 82.55,56.9 82.8,56.64 82.8,49.78 82.55,49.53 64.26,49.53 64.01,49.78 64.01,56.9
N$22
  Top 0.406: R13.2 LED.1
N$23
  Top 0.254: Q5.1 35.67,31.06 R10.1
N$39
  Top 0.813: VCC_SELECT.2 42.16,5.21 VCC.6 | VCC.6 VCC.4 VCC.2 VCC.1 VCC.3 VCC.5 VCC.7 VCC.8 | VCC.8 VCC.6 | VCC_4.1 VCC_4.2 VCC_4.3 VCC_4.4 VCC_4.5 VCC_4.6 VCC_4.7 VCC_4.8 VCC_4.9 VCC_4.10 VCC_4.11 VCC_4.12 VCC_4.13 VCC_4.14 VCC_4.15 93.47,53.85 89.41,57.91 57.91,57.91 52.83,52.83 VCC_3.1 VCC_3.2 VCC_3.3 VCC_3.4 VCC_3.5 VCC_3.6 VCC_3.7 VCC_3.8 VCC_3.9 VCC_3.10 VCC_3.11 VCC_3.12 VCC_3.13 VCC_3.14 VCC_3.15 52.83,10.41 51.82,9.4 46.74,9.4 45.47,8.13 VCC.8
NC1
  Bottom 2: RELAY2.1 14.22,39.12 K2.3
NC2
  Top 2: RELAY1.1 12.19,63.5 13.72,65.02 13.72,75.44 13.82,75.54 K1.4
NC3
  Bottom 2: RELAY3.1 14.22,23.63 K6.3
NO1
  Bottom 2: RELAY2.3 12.45,58.17 14.22,56.39 14.22,50.3 K2.2
NO2
  Bottom 2: RELAY1.3 8.13,73.66 9.91,75.44 9.91,79.5 11.43,81.03 20.07,81.03 21.42,79.68 K1.3
NO3
  Bottom 2: RELAY3.3 13.72,34.29 K6.2
NO4
  Top 2: K3.2 20.57,14.48 19.56,15.49 10.67,15.49 10.41,15.24 RELAY5.2
NO5
  Bottom 2: RELAY4.2 7.11,26.42 9.65,23.88 9.65,17.53 11.18,16 19.3,16 20.57,17.27 K5.2
RTS
  Top 0.254: R12.1 68.34,11.72 Q7.2 68.39,15.05 69.41,16.07 IC3.2
VBUS  (via drill 0.35)  (1 unrouted)
  Top 0.406: USB.B4_A9 76.82,7.99 77.47,8.64 F1.1 | F1.1 77.47,10.92 77.31,11.08 C18.2 74.51,11.08 74.17,11.43 v74.17,14.22 | F1.1 79.12,9.88 C19.1 | IC3.15 67.5,18.61 v67.56,18.54
  Bottom 0.406: v74.17,14.22 74.17,17.78 73.41,18.54 v67.56,18.54
VBUS_  (via drill 0.35)
  Top 0.254: C6.1 F1.2
  Top 0.406: v79.76,12.19 79.25,12.19 78.96,12.48 F1.2
  Bottom 0.406: JP1.1 68.83,4.57 69.34,4.06 81.28,4.06 81.79,4.57 81.79,11.43 81.03,12.19 v79.76,12.19
VCC
  Top 0.813: INPUT.1 87.38,69.09 86.75,68.46 FB1.2
VCC/2  (via drill 0.35)
  Top 0.813: C17.1 86.87,63.79 86.87,66.04 86.24,66.66 FB1.1 80.35,66.66 C16.1 80.52,66.5 80.52,64.26 v80.26,64.01 81.79,64.01 | IC1.1 70.5,68.33 v69.09,68.33
  Bottom 0.406: VIN.4 VIN.3
  Bottom 0.813: v69.09,68.33 68.33,67.56 68.33,64.77 | 68.33,64.77 69.09,64.01 v80.26,64.01 | 68.33,64.77 67.56,64.01 56.13,64.01 VIN.7 | VIN.7 VIN.8 VIN.6 VIN.4 VIN.2 VIN.1 VIN.3 VIN.5 VIN.7

## Text on the board
tPlace: 5-30VDC | - | + | DESIGN BY / POSITRON / ELEKTRONIK | 3V3 | 5V | ESP32/NODEMCU / RELAY SHIELD
bPlace: NO | COM | NC | NO | COM | NC | NO | COM | NC | NO | COM | NO | COM